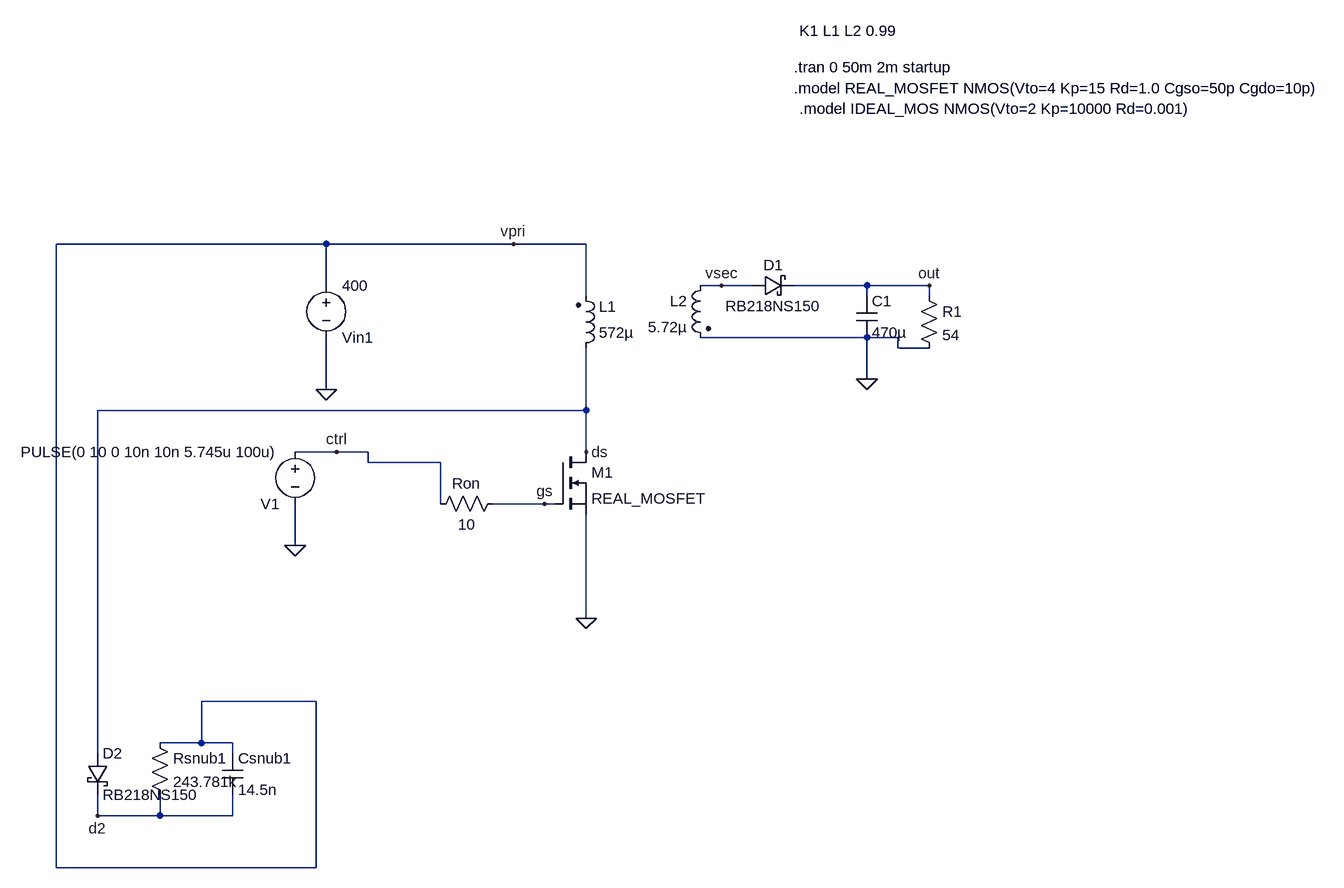
[diagram p0: schematic Draft6.asc]
Draft6.asc, the LTspice schematic file:
Version 4
SHEET 1 1052 964
WIRE -528 0 -944 0
WIRE -240 0 -528 0
WIRE -128 0 -240 0
WIRE -528 64 -528 0
WIRE 80 64 48 64
WIRE 128 64 80 64
WIRE 304 64 192 64
WIRE 400 64 304 64
WIRE -128 80 -128 0
WIRE 304 80 304 64
WIRE 400 80 400 64
WIRE 304 144 48 144
WIRE 352 144 304 144
WIRE 352 160 352 144
WIRE 400 160 352 160
WIRE 304 208 304 144
WIRE -528 224 -528 144
WIRE -128 256 -128 160
WIRE -128 256 -880 256
WIRE -512 320 -576 320
WIRE -464 320 -512 320
WIRE -128 320 -128 256
WIRE -464 336 -464 320
WIRE -352 336 -464 336
WIRE -352 400 -352 336
WIRE -192 400 -272 400
WIRE -176 400 -192 400
WIRE -576 464 -576 400
WIRE -128 576 -128 416
WIRE -544 704 -720 704
WIRE -720 768 -720 704
WIRE -720 768 -784 768
WIRE -672 768 -720 768
WIRE -880 784 -880 256
WIRE -672 784 -672 768
WIRE -880 880 -880 848
WIRE -784 880 -784 848
WIRE -784 880 -880 880
WIRE -672 880 -672 848
WIRE -672 880 -784 880
WIRE -944 960 -944 0
WIRE -544 960 -544 704
WIRE -544 960 -944 960
FLAG 304 208 0
FLAG -128 576 0
FLAG -528 224 0
FLAG 400 64 out
FLAG -880 880 d2
FLAG -240 0 vpri
FLAG 80 64 vsec
FLAG -512 320 ctrl
FLAG -576 464 0
FLAG -192 400 gs
FLAG -128 320 ds
SYMBOL ind2 -144 176 M180
WINDOW 0 36 80 Left 2
WINDOW 3 36 40 Left 2
SYMATTR InstName L1
SYMATTR Value 572µ
SYMATTR Type ind
SYMBOL ind2 64 48 M0
SYMATTR InstName L2
SYMATTR Value 5.72µ
SYMATTR Type ind
SYMBOL schottky 128 80 R270
WINDOW 0 32 32 VTop 2
WINDOW 3 0 32 VBottom 2
SYMATTR InstName D1
SYMATTR Value RB218NS150
SYMATTR Description Diode
SYMATTR Type diode
SYMBOL cap 288 80 R0
SYMATTR InstName C1
SYMATTR Value 470µ
SYMBOL voltage -528 48 R0
WINDOW 0 24 96 Left 2
WINDOW 3 24 16 Left 2
WINDOW 123 0 0 Left 0
WINDOW 39 0 0 Left 0
SYMATTR InstName Vin1
SYMATTR Value 400
SYMBOL res 384 64 R0
SYMATTR InstName R1
SYMATTR Value 54
SYMBOL voltage -576 304 M0
WINDOW 0 24 96 Left 2
WINDOW 3 24 16 Left 2
WINDOW 123 0 0 Left 0
WINDOW 39 0 0 Left 0
SYMATTR InstName V1
SYMATTR Value PULSE(0 10 0 10n 10n 5.745u 100u)
SYMBOL schottky -896 784 R0
SYMATTR InstName D2
SYMATTR Value RB218NS150
SYMATTR Description Diode
SYMATTR Type diode
SYMBOL res -800 752 R0
SYMATTR InstName Rsnub1
SYMATTR Value 243.781k
SYMBOL cap -688 784 R0
SYMATTR InstName Csnub1
SYMATTR Value 14.5n
SYMBOL nmos -176 320 R0
SYMATTR InstName M1
SYMATTR Value REAL_MOSFET
SYMBOL res -256 384 R90
WINDOW 0 0 56 VBottom 2
WINDOW 3 32 56 VTop 2
SYMATTR InstName Ron
SYMATTR Value 10
TEXT 200 -328 Left 2 !K1 L1 L2 0.99
TEXT 192 -272 Left 2 !.tran 0 50m 2m startup
TEXT 192 -240 Left 2 !.model REAL_MOSFET NMOS(Vto=4 Kp=15 Rd=1.0 Cgso=50p Cgdo=10p)
TEXT 200 -208 Left 2 !.model IDEAL_MOS NMOS(Vto=2 Kp=10000 Rd=0.001)

The netlist it stands for:
* Draft6.asc
L1 ds vpri 572µ
L2 vsec 0 5.72µ
D1 vsec out RB218NS150
C1 out 0 470µ
Vin1 vpri 0 400
R1 out 0 54
V1 ctrl 0 PULSE(0 10 0 10n 10n 5.745u 100u)
D2 ds d2 RB218NS150
Rsnub1 vpri d2 243.781k
Csnub1 vpri d2 14.5n
M1 ds gs 0 0 REAL_MOSFET
Ron gs ctrl 10
.model D D
.lib standard.dio
.model NMOS NMOS
.model PMOS PMOS
.lib standard.mos
K1 L1 L2 0.99
.tran 0 50m 2m startup
.model REAL_MOSFET NMOS(Vto=4 Kp=15 Rd=1.0 Cgso=50p Cgdo=10p)
.model IDEAL_MOS NMOS(Vto=2 Kp=10000 Rd=0.001)
.backanno
.end